# Altium schematic sheet P1.schdoc
size 297 x 209 mm; Symbol: Drawing-Symbol_A4; @Project Name: OptoMos_2026-08-08_18-34-34; @Page Count: 1; @Update Date: 2026-08-08; @Create Date: 2026-08-08; @Schematic Name: Schematic1; @Page No: 1; @Page Name: P1; Company: EasyEDA.com; Version: V1.0; Page Size: A4; Device: Drawing-Symbol_A4; @Create Time: 18:34:52; @Update Time: 18:34:52; Border: 1; Width: 1170; Height: 825; Region Start: 1; X Region Count: 6; Y Region Count: 4; Blade Width: 10; Title Block Position: 3; @Board Name: Board1
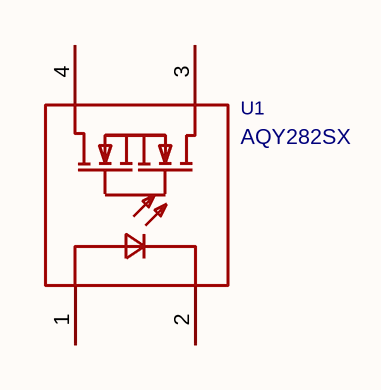
[diagram p0: P1.schdoc]

## Parts
U1  AQY282SX  [SOP-4_L4.3-W4.4-P2.54-LS7.0-BL]

## Nets

Not connected (* = marked no-connect by the designer): U1 1 2 3 4

## Notes on the sheet
- Create at
- 2026-08-08
- Schematic
- Board
- Schematic1
- Board1
- Update at
- Page
- P1
- Drawn
- Reviewed
- OptoMos_2026-08-08_18-34-34
- Version
- V1.0
- Size
- A4
- Page  1  Total  1
- EasyEDA.com

## Library data of the parts
U1 = AQY282SX: Contact Form:SPST-NO(1 Form A) Load Current:500mA Load Voltage:60V Load Voltage:60V Voltage - Forward(Vf):1.25V Forward Current(If):50mA RDS(on):850mΩ Isolation Voltage(Vrms):1.5kV Turn-on time:900us Turn-off time:500us Input Type:AC,DC Operating Temperat; Manufacturer: PANASONIC(松下); AddInBom: yes; ModelId: 43a8e8732de74b24a167faf554c5dad40819f05c4eef4c71ace90d822a990e87; ModelName: SOP-4_L4.4-W4.6-H2.1-LS7.0-P2.54; ModelTransform: 173.228,283.69762,0,0,0,0,0,0.005,0; Load Current: 500mA; Load Voltage: 60V; Voltage - Forward(Vf): 1.25V; Forward Current(If): 50mA; RDS(on): 850mΩ; Isolation Voltage(Vrms): 1.5kV; Turn-on time: 900us; Turn-off time: 500us; Input Type: AC,DC; Total Power Dissipation(Pd): 350mW; Insulation Resistance: 1000MΩ; Symbol: AQY282SX; Device: AQY282SX; Supplier: LCSC; Supplier Part: C250827; Manufacturer Part: AQY282SX; JLCPCB Part Class: Extended Part; LCSC Part Name: 1 Form A(SPSTNO) 负载AC,DC 负载电压60V; Supplier Footprint: SOP-4-2.54mm; Datasheet: https://item.szlcsc.com/datasheet/AQY282SX/246604.html; ConvertToPcb: yes; FootprintName: SOP-4_L4.3-W4.4-P2.54-LS7.0-BL; Contact Form: SPST-NO(1 Form A); Operating Temperature: -40℃~+85℃